# Altium schematic sheet LTC_Soft.SchDoc
size A4; SheetNumber: 7; SheetTotal: 10
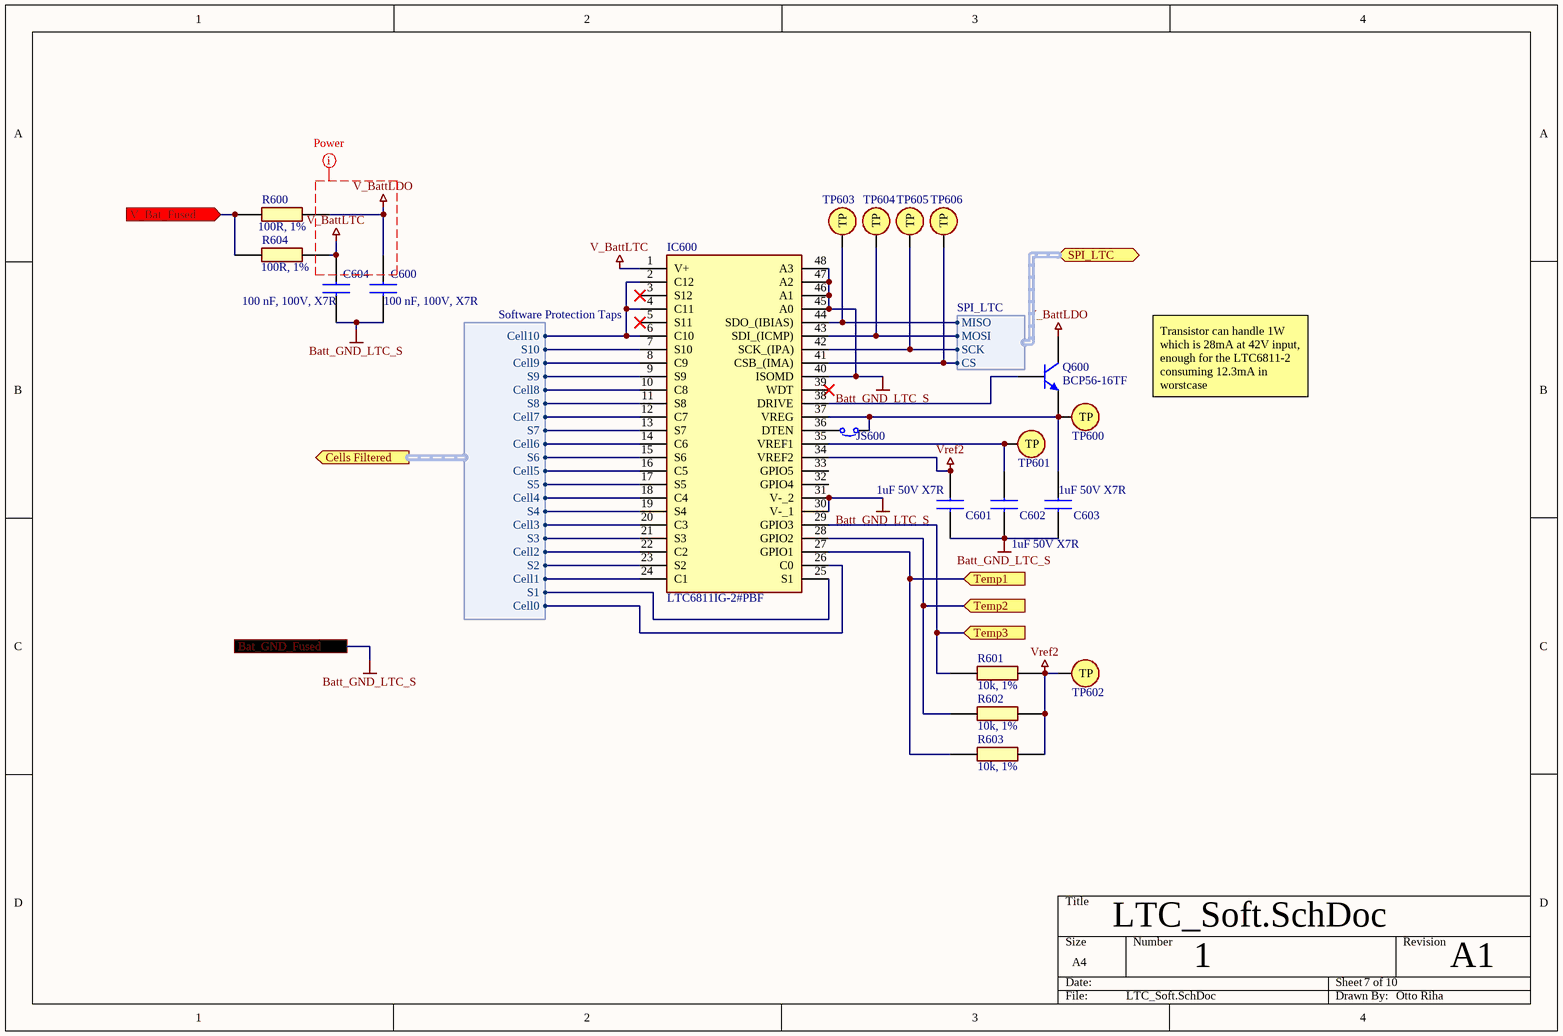
[diagram p0: LTC_Soft.SchDoc]

## Parts
C600  100 nF, 100V, X7R  [MAJx16]
C601  1uF 50V X7R  [CAPC1608X90N]
C602  1uF 50V X7R  [CAPC1608X90N]
C603  1uF 50V X7R  [CAPC1608X90N]
C604  100 nF, 100V, X7R  [MAJx16]
IC600  LTC6811IG-2#PBF  [SOP50P780X200-48N]
JS600  SolderJumper  [SolderJumper]  (value not drawn)
Q600  BCP56-16TF  [SOT230P700X180-4N]
R600  100R, 1%  [RESC1608X50N]
R601  value 10k, 1%  [RESC1608X50N]  (hidden comment: CRCW060310K0FKEI)
R602  value 10k, 1%  [RESC1608X50N]  (hidden comment: CRCW060310K0FKEI)
R603  value 10k, 1%  [RESC1608X50N]  (hidden comment: CRCW060310K0FKEI)
R604  100R, 1%  [RESC1608X50N]
TP600  Testpoint  [Testpoint]  (value not drawn)
TP601  Testpoint  [Testpoint]  (value not drawn)
TP602  Testpoint  [Testpoint]  (value not drawn)
TP603  Testpoint  [Testpoint]  (value not drawn)
TP604  Testpoint  [Testpoint]  (value not drawn)
TP605  Testpoint  [Testpoint]  (value not drawn)
TP606  Testpoint  [Testpoint]  (value not drawn)

## Ports
Bat_GND_Fused (see Main[4B]), Cells Filtered (out, harness Software Protection Taps, see Main[4B]), SPI_LTC (bidir, harness SPI_LTC, see Main[4B], MCU[3C]), Temp1 (in, see Main[4B]), Temp2 (in, see Main[4B]), Temp3 (in, see Main[4B]), V_Bat_Fused (in, see Main[4B])

## Harnesses
Software Protection Taps: Cell0, Cell1, Cell2, Cell3, Cell4, Cell5, Cell6, Cell7, Cell8, Cell9, Cell10, S1, S2, S3, S4, S5, S6, S7, S8, S9, S10
SPI_LTC: MOSI, MISO, SCK, CS

## Nets
Batt_GND_LTC_S: C600.1 C601.2 C602.2 C603.2 C604.1 IC600.30(V-_1) IC600.31(V-_2) IC600.40(ISOMD) IC600.45(A0) IC600.46(A1) IC600.47(A2) IC600.48(A3) ; port Bat_GND_Fused
V_BattLDO: C600.2 Q600.2(C) R600.2
V_BattLTC: C604.2 IC600.1(V+) R604.2
Vref2: C601.1 IC600.34(VREF2) R601.1 R602.1 R603.1 TP602.1(TP)
Temp1: IC600.27(GPIO1) R603.2 ; port Temp1
Temp2: IC600.28(GPIO2) R602.2 ; port Temp2
Temp3: IC600.29(GPIO3) R601.2 ; port Temp3
V_Bat_Fused: R600.1 R604.1 ; port V_Bat_Fused
NetC602_1: C602.1 IC600.35(VREF1) TP601.1(TP)
NetC603_1: C603.1 IC600.37(VREG) JS600.2 Q600.3(E) TP600.1(TP)
NetIC600_2: IC600.2(C12) IC600.4(C11) IC600.6(C10) ; port Cells Filtered.Cell10
NetIC600_7: IC600.7(S10) ; port Cells Filtered.S10
NetIC600_8: IC600.8(C9) ; port Cells Filtered.Cell9
NetIC600_9: IC600.9(S9) ; port Cells Filtered.S9
NetIC600_10: IC600.10(C8) ; port Cells Filtered.Cell8
NetIC600_11: IC600.11(S8) ; port Cells Filtered.S8
NetIC600_12: IC600.12(C7) ; port Cells Filtered.Cell7
NetIC600_13: IC600.13(S7) ; port Cells Filtered.S7
NetIC600_14: IC600.14(C6) ; port Cells Filtered.Cell6
NetIC600_15: IC600.15(S6) ; port Cells Filtered.S6
NetIC600_16: IC600.16(C5) ; port Cells Filtered.Cell5
NetIC600_17: IC600.17(S5) ; port Cells Filtered.S5
NetIC600_18: IC600.18(C4) ; port Cells Filtered.Cell4
NetIC600_19: IC600.19(S4) ; port Cells Filtered.S4
NetIC600_20: IC600.20(C3) ; port Cells Filtered.Cell3
NetIC600_21: IC600.21(S3) ; port Cells Filtered.S3
NetIC600_22: IC600.22(C2) ; port Cells Filtered.Cell2
NetIC600_23: IC600.23(S2) ; port Cells Filtered.S2
NetIC600_24: IC600.24(C1) ; port Cells Filtered.Cell1
NetIC600_25: IC600.25(S1) ; port Cells Filtered.S1
NetIC600_26: IC600.26(C0) ; port Cells Filtered.Cell0
NetIC600_36: IC600.36(DTEN) JS600.1
NetIC600_38: IC600.38(DRIVE) Q600.1(B)
NetIC600_41: IC600.41(CSB_(IMA)) TP606.1(TP) ; port SPI_LTC.CS
NetIC600_42: IC600.42(SCK_(IPA)) TP605.1(TP) ; port SPI_LTC.SCK
NetIC600_43: IC600.43(SDI_(ICMP)) TP604.1(TP) ; port SPI_LTC.MOSI
NetIC600_44: IC600.44(SDO_(IBIAS)) TP603.1(TP) ; port SPI_LTC.MISO

Not connected (* = marked no-connect by the designer): IC600 3(S12)* 5(S11)* 32(GPIO4) 33(GPIO5) 39(WDT)*

## Layout directives
net class Batt+: V_BattLDO, V_BattLTC

## Notes on the sheet
- Transistor can handle 1W which is 28mA at 42V input, enough for the LTC6811-2 consuming 12.3mA in worstcase
- 1
- A1
- Otto Riha

## Library data of the parts
C600 C604 = MAJCH168BB7104KTEA01: Capacitor 100nF, 100V, X7R; Manufacturer_Name: TAIYO YUDEN; Datasheet Link: https://ds.yuden.co.jp/TYCOMPAS/or/detail?pn=MAJCH168BB7104KTEA01; Height: 0.8mm; Manufacturer_Part_Number: MAJCH168BB7104KTEA01; Mouser Part Number: 963-MAJCH168BB7104KT; Mouser Price/Stock: https://www.mouser.co.uk/ProductDetail/TAIYO-YUDEN/MAJCH168BB7104KTEA01?qs=ZcfC38r4PovaTBrG0IdezQ%3D%3D; Arrow Part Number: MAJCH168BB7104KTEA01; Arrow Price/Stock: https://www.arrow.com/en/products/majch168bb7104ktea01/taiyo-yuden?utm_currency=USD&region=nac; Supplier 1: Mouser; Supplier Part Number 1: 963-MAJCH168BB7104KT
C601-C603 = 06035C105MAT2A: Capacitor 1uF 50V X7R; Manufacturer_Name: Kyocera AVX; Datasheet Link: https://componentsearchengine.com/Datasheets/1/06031A100FAT2A.pdf; Height: 0.9mm; Manufacturer_Part_Number: 06035C105MAT2A; Mouser Part Number: 581-06035C105MAT2A; Mouser Price/Stock: https://www.mouser.co.uk/ProductDetail/KYOCERA-AVX/06035C105MAT2A?qs=%252BdQmOuGyFcHMsevPtc6OZQ%3D%3D; Value: 1uF
IC600 = LTC6811IG-2#PBF: Integrated Circuit; Manufacturer_Name: Analog Devices; Datasheet Link: https://datasheet.datasheetarchive.com/originals/distributors/DKDS42/DSANUWW0041878.pdf; Height: 2mm; Manufacturer_Part_Number: LTC6811IG-2#PBF; Mouser Part Number: 584-LTC6811IG-2#PBF; Mouser Price/Stock: https://www.mouser.co.uk/ProductDetail/Analog-Devices/LTC6811IG-2PBF?qs=oahfZPh6IAI0fFYgAupCpg%3D%3D; Arrow Part Number: LTC6811IG-2#PBF; Arrow Price/Stock: https://www.arrow.com/en/products/ltc6811ig-2pbf/analog-devices?region=nac
Q600 = BCP56-16TF: Transistor BJT NPN; Manufacturer_Name: Nexperia; Datasheet Link: https://assets.nexperia.com/documents/data-sheet/BCP56T_SER.pdf; Height: 1.8mm; Manufacturer_Part_Number: BCP56-16TF; Mouser Part Number: 771-BCP56-16TF; Mouser Price/Stock: https://www.mouser.co.uk/ProductDetail/Nexperia/BCP56-16TF?qs=uj7TeyS2Sj96ubfysKmpcg%3D%3D; Arrow Part Number: BCP56-16TF; Arrow Price/Stock: https://www.arrow.com/en/products/bcp56-16tf/nexperia?region=nac
R600 R604 = CRCW0603100RFKEA: Resistor 100R, 1%; Manufacturer_Name: Vishay; Datasheet Link: http://www.vishay.com/docs/20035/dcrcwe3.pdf; Height: 0.5mm; Manufacturer_Part_Number: CRCW0603100RFKEA; Mouser Part Number: 71-CRCW0603-100-E3; Mouser Price/Stock: https://www.mouser.co.uk/ProductDetail/Vishay-Dale/CRCW0603100RFKEA?qs=90AHS1y%2FsidGWjjxZAupKg%3D%3D; Arrow Part Number: CRCW0603100RFKEA; Arrow Price/Stock: https://www.arrow.com/en/products/crcw0603100rfkea/vishay?utm_currency=USD&region=europe; Supplier 1: Mouser; Supplier Part Number 1: 71-CRCW0603-100-E3; Value: 100R
R601-R603 = CRCW060310K0FKEI: Resistor 10k, 1%; Manufacturer_Name: Vishay; Datasheet Link: http://www.vishay.com/docs/20035/dcrcwe3.pdf; Height: 0.5mm; Manufacturer_Part_Number: CRCW060310K0FKEI; Mouser Part Number: 71-CRCW060310K0FKEI; Mouser Price/Stock: https://www.mouser.co.uk/ProductDetail/Vishay-Dale/CRCW060310K0FKEI?qs=3qWEzBg5KnKofE%252B8acPBRA%3D%3D; Arrow Part Number: CRCW060310K0FKEI; Arrow Price/Stock: https://www.arrow.com/en/products/crcw060310k0fkei/vishay?utm_currency=USD&region=nac; Supplier 1: Mouser; Supplier Part Number 1: 71-CRCW060310K0FKEI